# Altium schematic sheet WL-BPF_L.SchDoc
size 420 x 297 mm; Address1: Address1; Address2: Address2; Address3: Address3; Address4: Address4; DocumentNumber: Wolf-Lite; SheetNumber: 11; Scale: 1:1; DocumentType: Схема электрическая принципиальная; FirstReferrence: АБВГ.123456.001
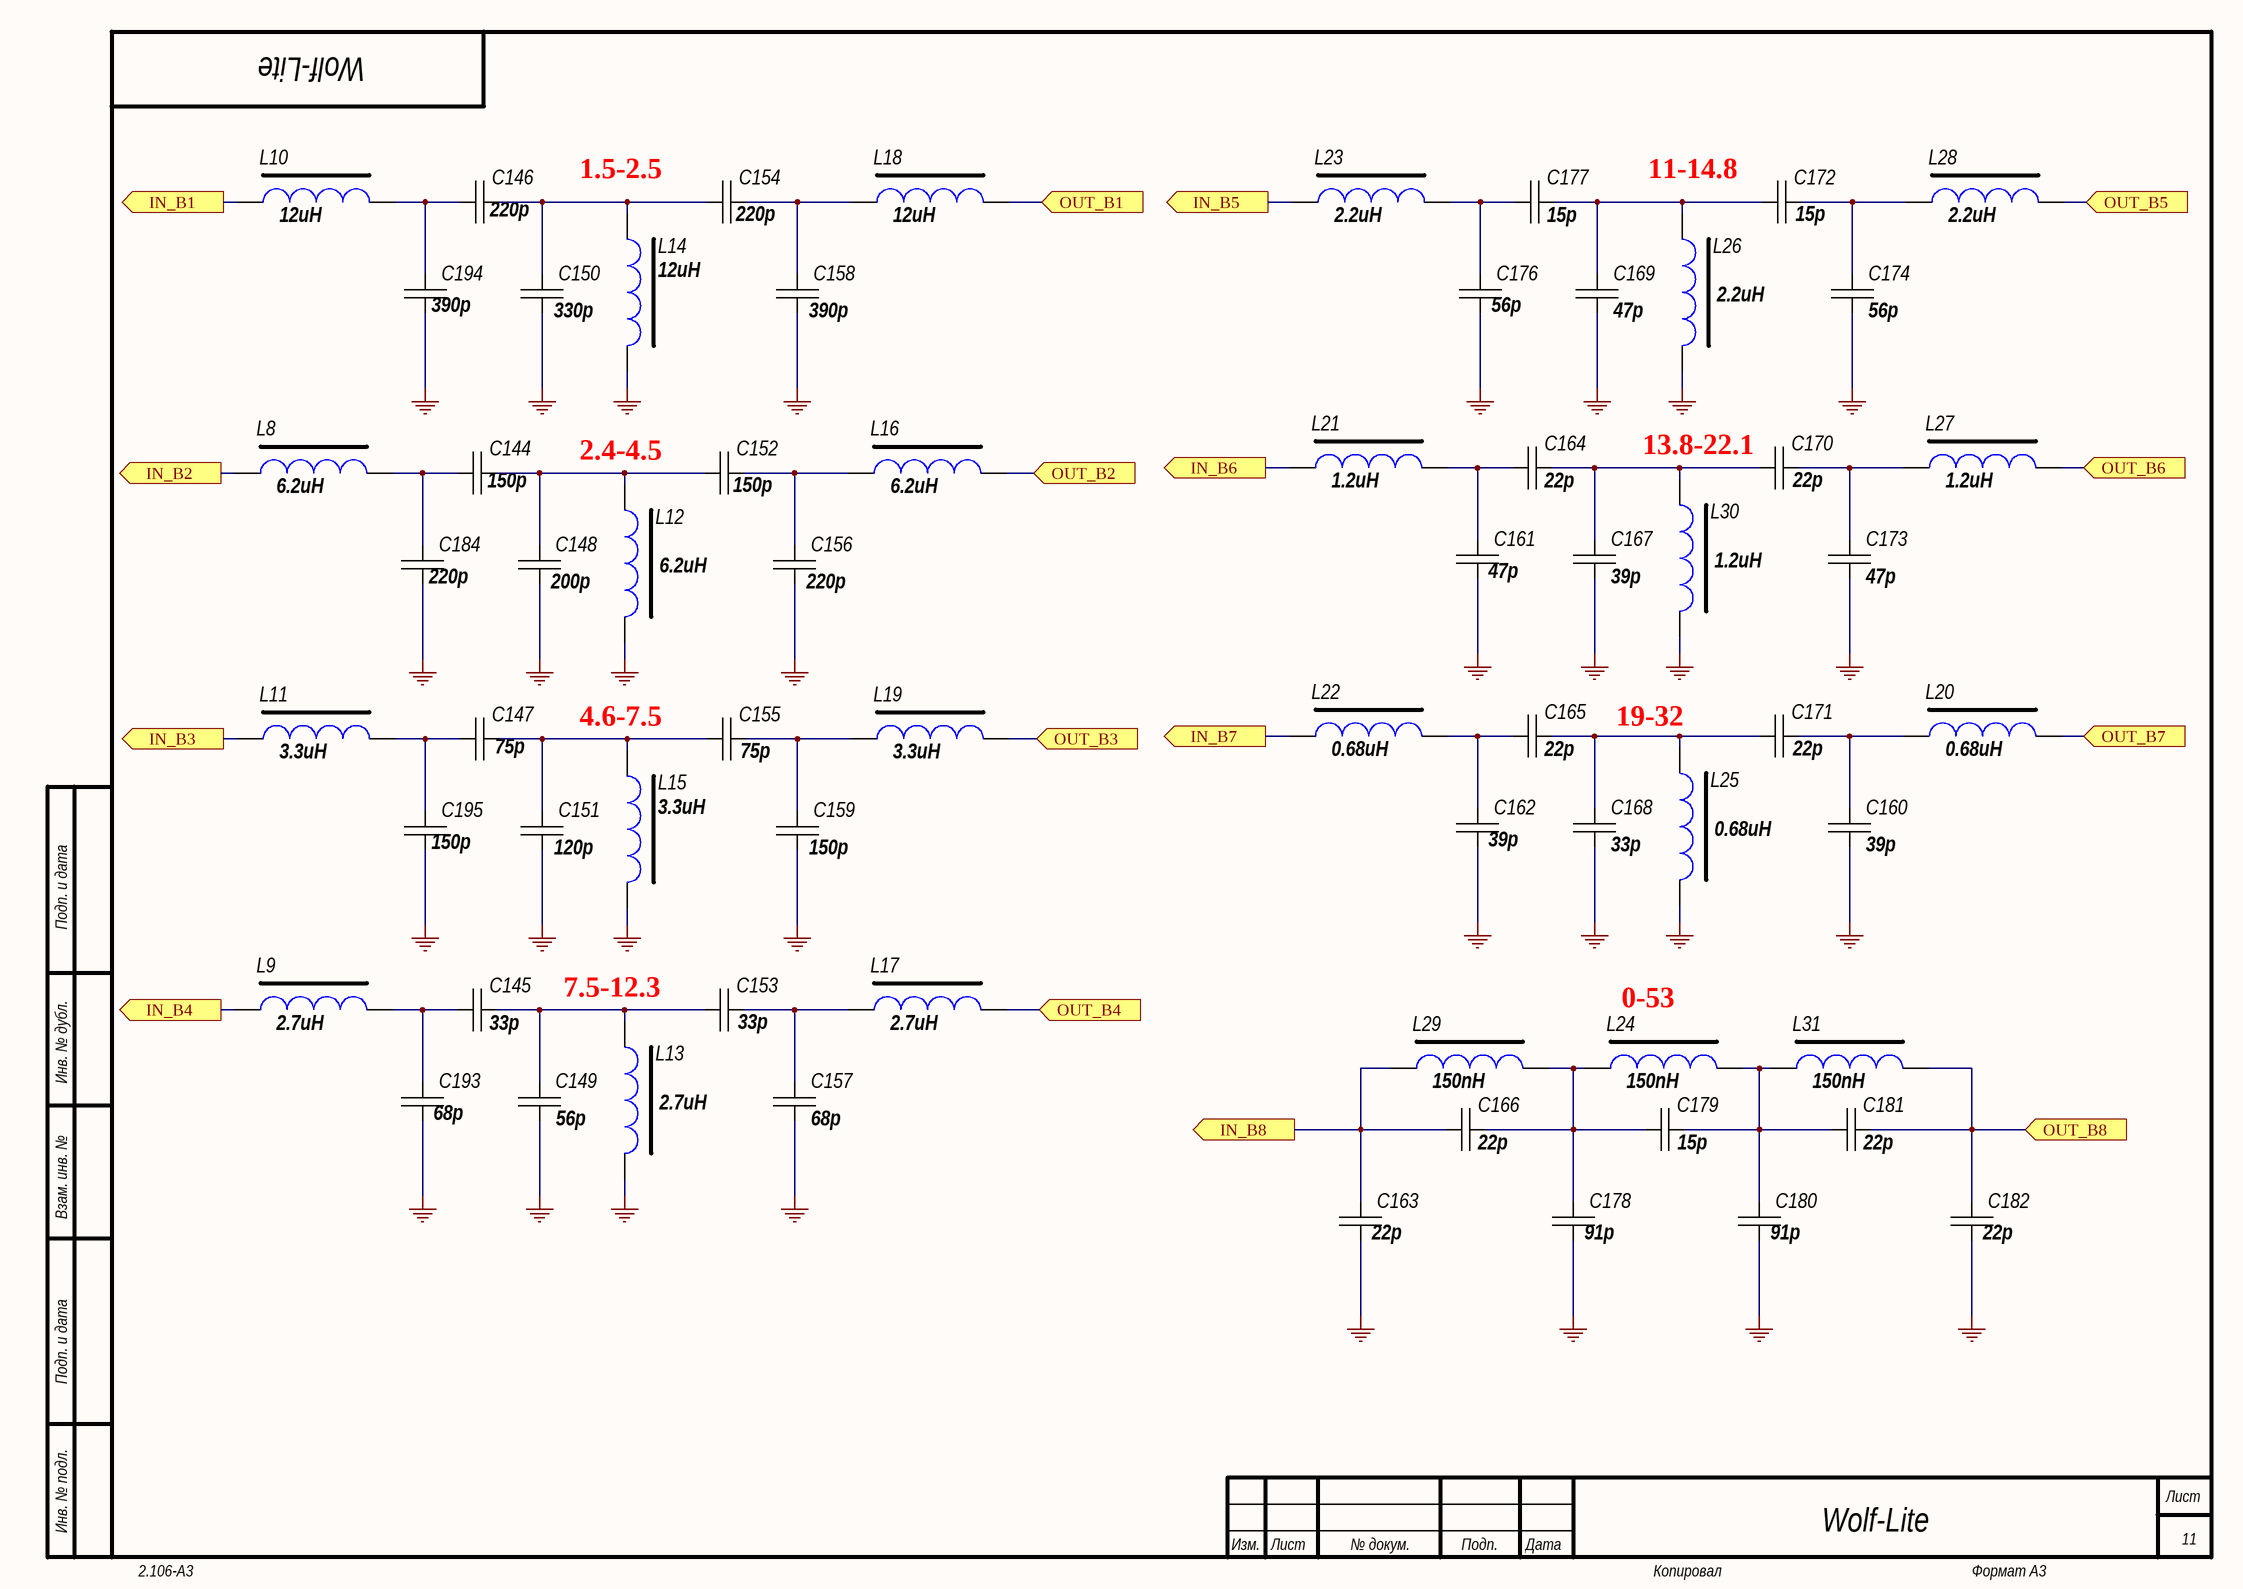
[diagram p0: WL-BPF_L.SchDoc]

## Parts
C144  150p  [CH0805C]
C145  33p  [CH0805C]
C146  220p  [CH0805C]
C147  75p  [CH0805C]
C148  200p  [CH0805C]
C149  56p  [CH0805C]
C150  330p  [CH0805C]
C151  120p  [CH0805C]
C152  150p  [CH0805C]
C153  33p  [CH0805C]
C154  220p  [CH0805C]
C155  75p  [CH0805C]
C156  220p  [CH0805C]
C157  68p  [CH0805C]
C158  390p  [CH0805C]
C159  150p  [CH0805C]
C160  39p  [CH0805C]
C161  47p  [CH0805C]
C162  39p  [CH0805C]
C163  22p  [CH0805C]
C164  22p  [CH0805C]
C165  22p  [CH0805C]
C166  22p  [CH0805C]
C167  39p  [CH0805C]
C168  33p  [CH0805C]
C169  47p  [CH0805C]
C170  22p  [CH0805C]
C171  22p  [CH0805C]
C172  15p  [CH0805C]
C173  47p  [CH0805C]
C174  56p  [CH0805C]
C176  56p  [CH0805C]
C177  15p  [CH0805C]
C178  91p  [CH0805C]
C179  15p  [CH0805C]
C180  91p  [CH0805C]
C181  22p  [CH0805C]
C182  22p  [CH0805C]
C184  220p  [CH0805C]
C193  68p  [CH0805C]
C194  390p  [CH0805C]
C195  150p  [CH0805C]
L8  6.2uH  [L1210]
L9  2.7uH  [L1210]
L10  12uH  [L1210]
L11  3.3uH  [L1210]
L12  6.2uH  [L1210]
L13  2.7uH  [L1210]
L14  12uH  [L1210]
L15  3.3uH  [L1210]
L16  6.2uH  [L1210]
L17  2.7uH  [L1210]
L18  12uH  [L1210]
L19  3.3uH  [L1210]
L20  0.68uH  [L1210]
L21  1.2uH  [L1210]
L22  0.68uH  [L1210]
L23  2.2uH  [L1210]
L24  150nH  [L1210]
L25  0.68uH  [L1210]
L26  2.2uH  [L1210]
L27  1.2uH  [L1210]
L28  2.2uH  [L1210]
L29  150nH  [L1210]
L30  1.2uH  [L1210]
L31  150nH  [L1210]

## Ports
IN_B1 (out), IN_B2 (out), IN_B3 (out), IN_B4 (out), IN_B5 (out), IN_B6 (out), IN_B7 (out), IN_B8 (out), OUT_B1 (in), OUT_B2 (in), OUT_B3 (in), OUT_B4 (in), OUT_B5 (in), OUT_B6 (in), OUT_B7 (in), OUT_B8 (in)

## Nets
GND: C148.1 C149.1 C150.1 C151.1 C156.1 C157.1 C158.1 C159.1 C160.1 C161.1 C162.1 C163.1 C167.1 C168.1 C169.1 C173.1 C174.1 C176.1 C178.1 C180.1 C182.1 C184.1 C193.1 C194.1 C195.1 L12.1 L13.1 L14.1 L15.1 L25.1 L26.1 L30.1
IN_B1: L10.1 ; port IN_B1
IN_B2: L8.1 ; port IN_B2
IN_B3: L11.1 ; port IN_B3
IN_B4: L9.1 ; port IN_B4
IN_B5: L23.1 ; port IN_B5
IN_B6: L21.1 ; port IN_B6
IN_B7: L22.1 ; port IN_B7
IN_B8: C163.2 C166.1 L29.1 ; port IN_B8
OUT_B1: L18.2 ; port OUT_B1
OUT_B2: L16.2 ; port OUT_B2
OUT_B3: L19.2 ; port OUT_B3
OUT_B4: L17.2 ; port OUT_B4
OUT_B5: L28.2 ; port OUT_B5
OUT_B6: L27.2 ; port OUT_B6
OUT_B7: L20.2 ; port OUT_B7
OUT_B8: C181.2 C182.2 L31.2 ; port OUT_B8
NetC144_1: C144.1 C184.2 L8.2
NetC144_2: C144.2 C148.2 C152.1 L12.2
NetC145_1: C145.1 C193.2 L9.2
NetC145_2: C145.2 C149.2 C153.1 L13.2
NetC146_1: C146.1 C194.2 L10.2
NetC146_2: C146.2 C150.2 C154.1 L14.2
NetC147_1: C147.1 C195.2 L11.2
NetC147_2: C147.2 C151.2 C155.1 L15.2
NetC152_2: C152.2 C156.2 L16.1
NetC153_2: C153.2 C157.2 L17.1
NetC154_2: C154.2 C158.2 L18.1
NetC155_2: C155.2 C159.2 L19.1
NetC160_2: C160.2 C171.2 L20.1
NetC161_2: C161.2 C164.1 L21.2
NetC162_2: C162.2 C165.1 L22.2
NetC164_2: C164.2 C167.2 C170.1 L30.2
NetC165_2: C165.2 C168.2 C171.1 L25.2
NetC166_2: C166.2 C178.2 C179.1 L24.1 L29.2
NetC169_2: C169.2 C172.1 C177.2 L26.2
NetC170_2: C170.2 C173.2 L27.1
NetC172_2: C172.2 C174.2 L28.1
NetC176_2: C176.2 C177.1 L23.2
NetC179_2: C179.2 C180.2 C181.1 L24.2 L31.1

## Notes on the sheet
- 1.5-2.5
- (near C172) 11-14.8
- 2.4-4.5
- (near C170) 13.8-22.1
- 4.6-7.5
- (near L25) 19-32
- 7.5-12.3
- (near L24) 0-53
- Подп. и дата
- Инв. № дубл.
- Взам. инв. №
- Инв. № подл.
- Изм.
- Лист
- № докум.
- Подп.
- Дата
- 2.106-A3
- Копировал
- Формат А3

## Library data of the parts
C144-C174 C176-C182 C184 C193-C195 = Capacitor: Manufacturer: *; Model: *; HelpURL: *; ComponentKind: *; Value: *
L8-L31 = TRANS